# Altium schematic sheet RFID Reader Antenna.SchDoc
size A3; SheetNumber: 8; SheetTotal: 8
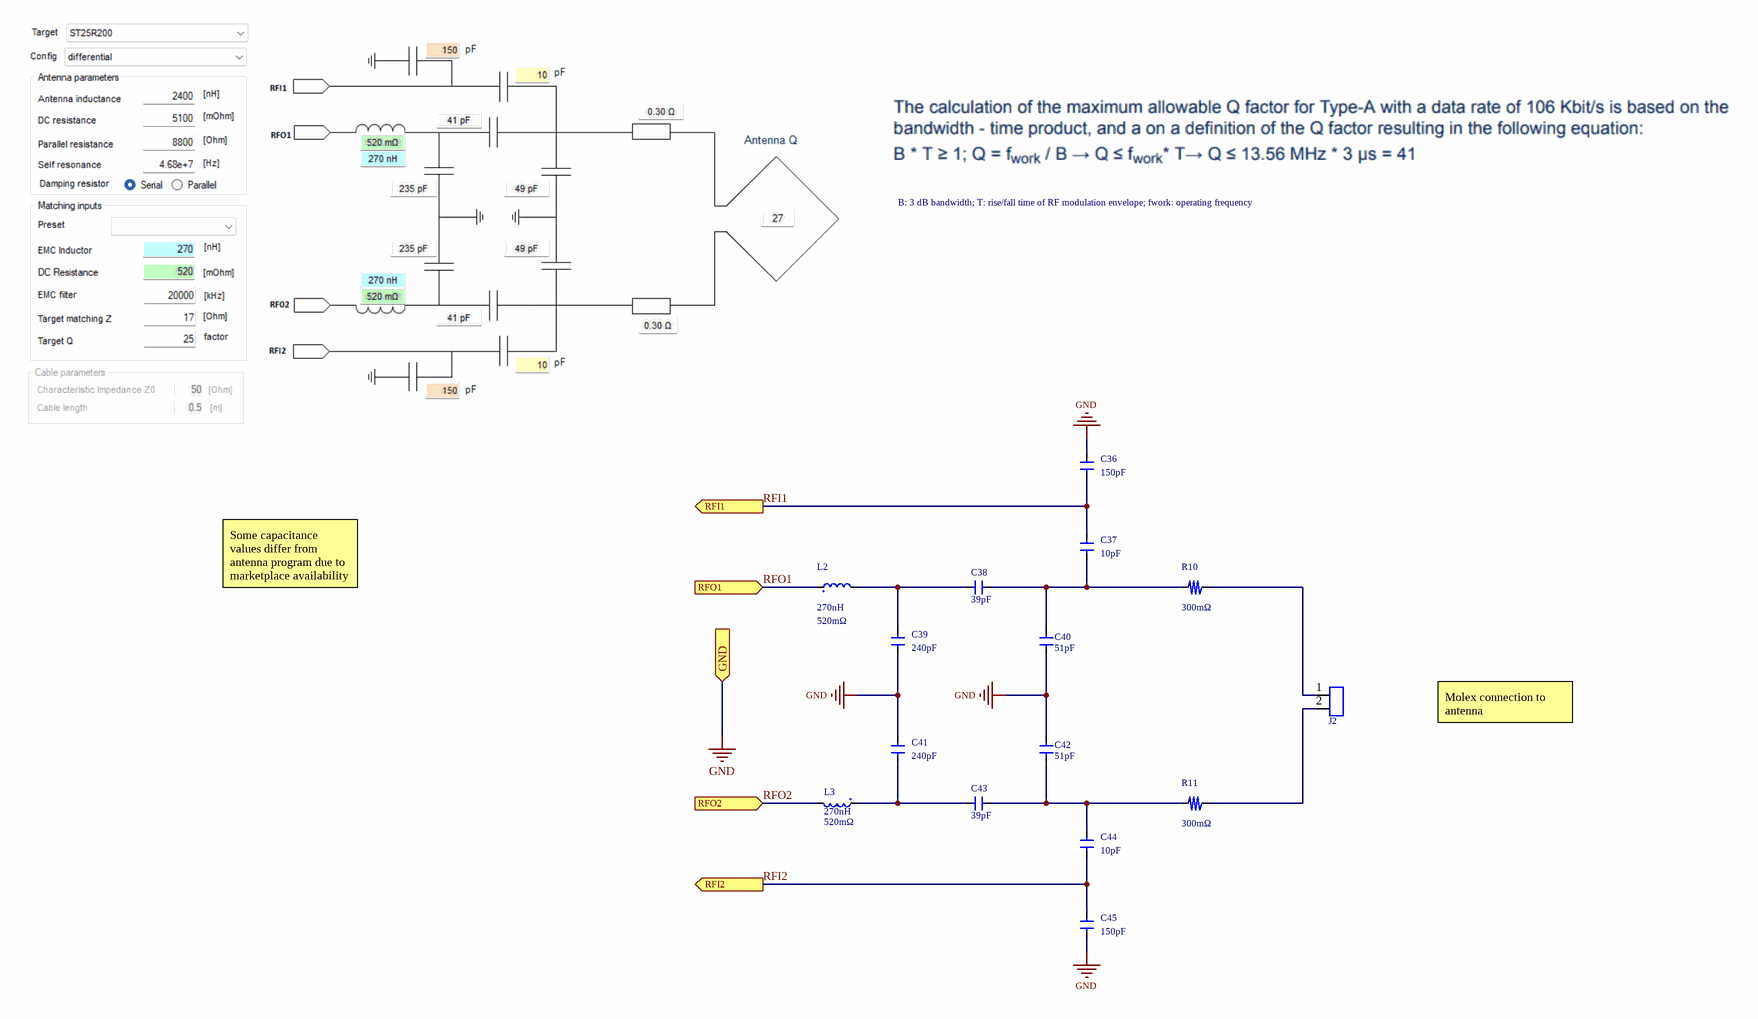
[diagram p0: RFID Reader Antenna.SchDoc]

## Parts
?  (no value)  (graphical)
C36  value 150pF  [SYK-STD-CAP-0805 - NOSILK]  (hidden comment: C0805C151J5GACTU)
C37  value 10pF  [SYK-STD-CAP-0805 - NOSILK]  (hidden comment: C0805C100C5GACTU)
C38  value 39pF  [SYK-STD-CAP-0805 - NOSILK]  (hidden comment: C0805C100C5GACTU)
C39  value 240pF  [SYK-STD-CAP-0805 - NOSILK]  (hidden comment: 600F241JT250XT4K)
C40  value 51pF  [SYK-STD-CAP-0805 - NOSILK]  (hidden comment: C0805C100C5GACTU)
C41  value 240pF  [SYK-STD-CAP-0805 - NOSILK]  (hidden comment: 600F241JT250XT4K)
C42  value 51pF  [SYK-STD-CAP-0805 - NOSILK]  (hidden comment: C0805C100C5GACTU)
C43  value 39pF  [SYK-STD-CAP-0805 - NOSILK]  (hidden comment: C0805C100C5GACTU)
C44  value 10pF  [SYK-STD-CAP-0805 - NOSILK]  (hidden comment: C0805C100C5GACTU)
C45  value 150pF  [SYK-STD-CAP-0805 - NOSILK]  (hidden comment: C0805C151J5GACTU)
J2  5055670281  [5055670281]  (value not drawn)
L2  value 270nH  DC Resistance: 520mΩ  [SYK-STD-IND-0402]  (hidden comment: LQW15CNR27J1ZD)
L3  value 270nH  DC Resistance: 520mΩ  [SYK-STD-IND-0402]  (hidden comment: LQW15CNR27J1ZD)
R10  value 300mΩ  [SYK-STD-RES-1206]  (hidden comment: SYK-RES-GEN-10k-1%-0.25W-1206)
R11  value 300mΩ  [SYK-STD-RES-1206]  (hidden comment: SYK-RES-GEN-10k-1%-0.25W-1206)

## Ports
GND (in), RFI1 (out), RFI2 (out), RFO1 (in), RFO2 (in)

## Nets
GND: C36.2 C39.1 C40.2 C41.2 C42.1 C45.1 ; port GND
RFI1: C36.1 C37.2 ; port RFI1
RFI2: C44.1 C45.2 ; port RFI2
RFO1: L2.1 ; port RFO1
RFO2: L3.2 ; port RFO2
NetC37_1: C37.1 C38.1 C40.1 R10.2
NetC38_2: C38.2 C39.2 L2.2
NetC41_1: C41.1 C43.2 L3.1
NetC42_2: C42.2 C43.1 C44.2 R11.2
NetJ2_1: J2.1 R10.1
NetJ2_2: J2.2 R11.1

## Notes on the sheet
- B: 3 dB bandwidth; T: rise/fall time of RF modulation envelope; fwork: operating frequency
- Some capacitance values differ from antenna program due to marketplace availability
- Molex connection to antenna
- LAYER NAME
- CRITICAL QUALITY ATTRIBUTE
- TITLE NAME
- THIS DRAWING CONTAINS CONFIDENTIAL INFORMATION AND IS ISSUED IN CONFIDENCE ON THE CONDITIONS
  THAT IT BE RETURNED ON DEMAND AND NOT BE COPIED, REPRODUCED, DISCLOSED TO OTHERS OR USED
  IN THE MANUFACTURE OF THE SUBJECT-MATTER THEREOF WITHOUT THE WRITTEN CONSENT OF
  STRYKER CORPORATION.
- SHALL BE COMPLIANT PER ES-1168 AND ES-1005
- SHEET
- OF
- NUMBER
- REV
- APPROVALS ARE FOUND IN PLM SYSTEM

## Library data of the parts
? = CMP-001-0000-v0.01.17: Stryker standard title block with pre-parameterized fields
C36 C45 = CMP-001-0758-v0.01.00: CAP CER 150PF 50V C0G/NP0 0805; Manufacturer: KEMET; Device Height: 880µm; Device Length: 2mm; Temperature Coefficient: C0G, NP0; Device Width: 1.25mm; Capacitor Type: Ceramic; Tolerance: 5%; Style Guide Revision: Librarian to Review; Case/Package: 0805 (2012 Metric); Voltage Rating: 50V; RoHS Compliant: Yes; REACH Compliant: Unaffected; Manufacturer Part Number: C0805C151J5GACTU; Mounting Technology: SMT; Moisture Sensitivity Level: 1; Ratings: -; Operating Temperature - Min: -55°C; Pins: 2; Critical Component: -; Operating Temperature - Max: 125°C
C37 C38 C40 C42-C44 = CMP-001-0759-v0.01.00: CAP CER 10PF 50V C0G/NP0 0805; Manufacturer: KEMET; Capacitor Type: Ceramic; Tolerance: 0.25%; Temperature Coefficient: C0G, NP0; Device Length: 2mm; Style Guide Revision: Librarian to Review; Device Height: 780µm; Device Width: 1.25mm; Features: Low ESL; Case/Package: 0805 (2012 Metric); Critical Component: -; Pins: 2; RoHS Compliant: Unknown; Moisture Sensitivity Level: 1; Mounting Technology: SMT; Operating Temperature - Max: 125°C; Operating Temperature - Min: -55°C; REACH Compliant: Unaffected; Manufacturer Part Number: C0805C100C5GACTU; Voltage Rating: 50V; Ratings: -
C39 C41 = CMP-001-0755-v0.01.00: CAP CER 240PF 250V C0G/NP0 0805; Manufacturer: KYOCERA AVX; Tolerance: 5%; Device Length: 2.01mm; Device Height: 1.3mm; Temperature Coefficient: C0G, NP0; Device Width: 1.25mm; Capacitor Type: Ceramic; Style Guide Revision: Librarian to Review; Operating Temperature - Min: -55°C; REACH Compliant: Unaffected; Manufacturer Part Number: 600F241JT250XT4K; Pins: 2; Moisture Sensitivity Level: 1; Critical Component: -; Voltage Rating: 250V; Case/Package: 0805 (2012 Metric); Ratings: -; Mounting Technology: SMT; Operating Temperature - Max: 125°C; Features: High Q, Low Loss, Ultra Low ESR; RoHS Compliant: Yes
J2 = CMP-001-0750-v0.01.00: CONN HEADER SMD R/A 2POS 1.25MM; Manufacturer Series: Micro-Lock PLUS 505567; Manufacturer: Molex; Material Flammability Rating: UL94 V-0; System: Connector; Style Guide Revision: Librarian to Review; Rows: 1; Connector Style: Wire to Board; Voltage Rating: 50V; Pins: 2; Insulation Material: Polyamide (PA), Nylon, Glass Filled; RoHS Compliant: Yes; Critical Component: -; REACH Compliant: Unaffected; Operating Temperature - Max: 105°C; Features: Pick and Place, Solder Retention; Mounting Technology: SMT; Operating Temperature - Min: -40°C; Connector Type: Header; Manufacturer Part Number: 5055670281
L2 L3 = CMP-001-0754-v0.01.00: General Purpose Inductor, 0.27uH, 5%, 1 Element, Ferrite-Core, SMD, 0402; Manufacturer: Murata Electronics; Current - Saturation: 420mA; Shielding: Unshielded; Device Height: 600µm; Device Length: 1mm; Style Guide Revision: Librarian to Review; Self Resonant Frequency: 830MHz; Critical Component: -; Moisture Sensitivity Level: 1; REACH Compliant: Unaffected; Operating Temperature - Max: 125°C; Mounting Technology: SMT; Tolerance: 5%; Current - Max: 420mA; Series: LQW15; RoHS Compliant: Yes; Operating Temperature - Min: -40°C; Device Width: 600µm; Pin Count: 2; Case/Package: 0402 (1005 Metric); Manufacturer Part Number: LQW15CNR27J1ZD; Core Material: Ferrite
R10 R11 = CMP-009-00311-v0.01.02: RES 10kΩ 1% 250mW 1206; Manufacturer: Generic; Style Guide Revision: AA; Device Length: 3.2mm; Device Width: 1.6mm; Voltage Rating: 200V; Temperature Coefficient: 100ppm/°C; Device Height: 550µm; Operating Temperature - Min: -55°C; Mounting Technology: SMT; Critical Component: -; Case/Package: 1206; RoHS Compliant: Yes; Operating Temperature - Max: 155°C; Pins: 2; Power: 250mW; Manufacturer Part Number: Generic; REACH Compliant: Unaffected; Pin Count: 2; Tolerance: 1%